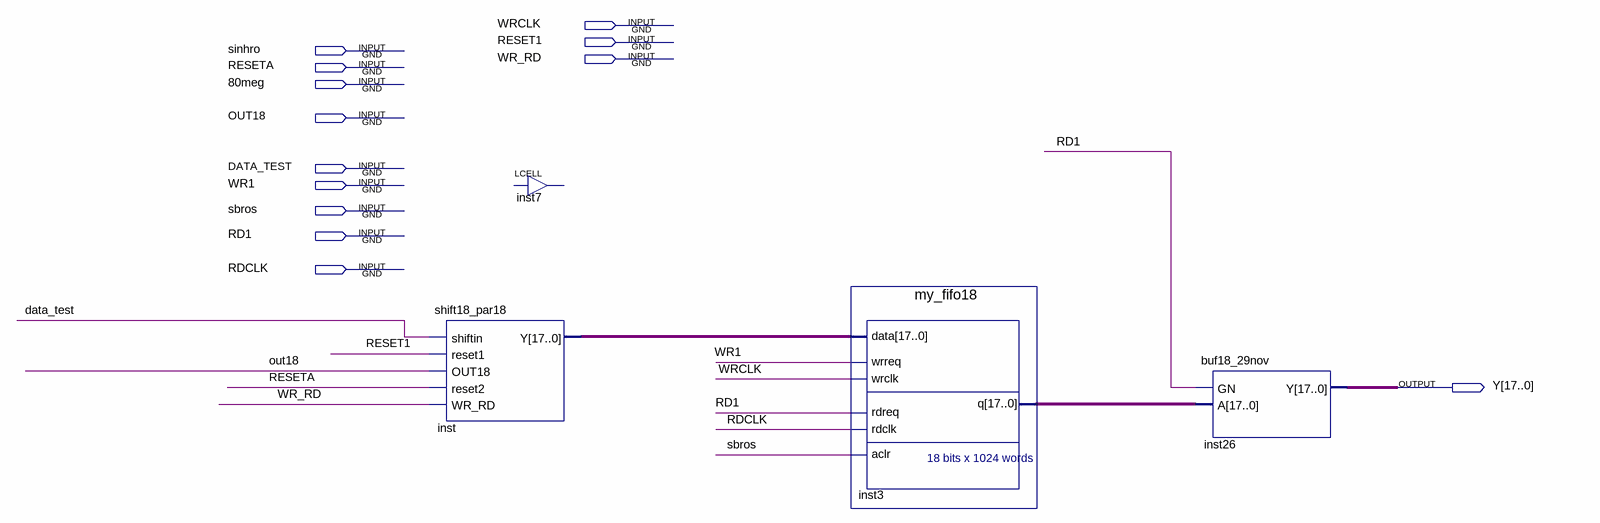
[diagram p0: schematic sheet]
// Quartus schematic BlockData_1Des.bdf as structural Verilog: 4 symbols, 13 pins
module BlockData_1Des (
  input  WRCLK,
  input  RESET1,
  input  sinhro,
  input  WR_RD,
  input  RESETA,
  input  \80meg ,
  input  OUT18,
  input  DATA_TEST,
  input  WR1,
  input  sbros,
  input  RD1,
  input  RDCLK,
  output [17:0] Y
);

  wire [17:0] inst3_q, inst_y;

  shift18_par18 inst (.shiftin(DATA_TEST), .reset1(RESET1), .OUT18(OUT18), .reset2(RESETA), .WR_RD(WR_RD), .Y(inst_y));
  LCELL inst7 ();  // open: IN, OUT
  my_fifo18 inst3 (.data(inst_y), .wrreq(WR1), .wrclk(WRCLK), .rdreq(RD1), .rdclk(RDCLK), .aclr(sbros), .q(inst3_q));
  buf18_29nov inst26 (.GN(RD1), .A(inst3_q), .Y(Y));
endmodule
